# EAGLE design fonte (EAGLE 9.6.2)
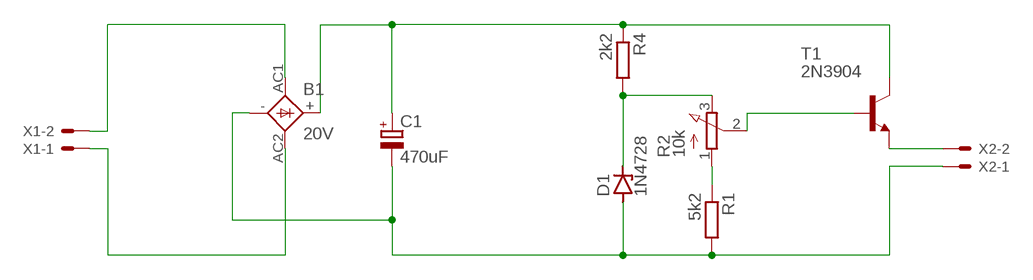
[diagram p0: schematic, sheet 1]

## Parts
B1  20V  1KAB  [1KAB]
C1  470uF  CPOL-EUE2,5-6E  [E2,5-6E]
D1  1N4728  [DO41Z10]
R1  5k2  R-EU_0207/10  [0207/10]
R2  10k  3RP/1610N  [3RP/1610N]
R4  2k2  R-EU_0207/10  [0207/10]
T1  2N3904  [TO92]
X1  22-23-2021  [22-23-2021]
X2  22-23-2021  [22-23-2021]

## Nets
N$1: B1.AC1 X1.2
N$2: B1.- C1.- D1.A R1.2 X2.1
N$3: R1.1 R2.1(A)
N$4: D1.C R2.3(E) R4.2
N$5: R2.2(S) T1.2(B)
N$6: B1.+ C1.+ R4.1 T1.1(C)
N$7: B1.AC2 X1.1
N$9: T1.3(E) X2.2

## Library data of the parts
B1 = rectifier:1KAB: RECTIFIER grid 5,08 x 5,08 mm
C1 = rcl:CPOL-EU: POLARIZED CAPACITOR, European symbol; SPICEPREFIX: C
D1 = diode:1N4728: Z DIODE 3.3 V, 1W, 5 percent
R1 R4 = rcl:R-EU_: RESISTOR, European symbol; SPICEPREFIX: R
R2 = pot:3RP/1610N: 16mm Potentiometer one level Source: http://www.alphapotentiometers.net/html/16mm_pot_2.html
T1 = transistor-neu-to92:2N3904: NPN TRANSISTOR
X1 X2 = con-molex:22-23-2021: .100" (2.54mm) Center Header - 2 Pin; MF: MOLEX; MPN: 22-23-2021; OC_FARNELL: 1462926; OC_NEWARK: 25C3832

## Board
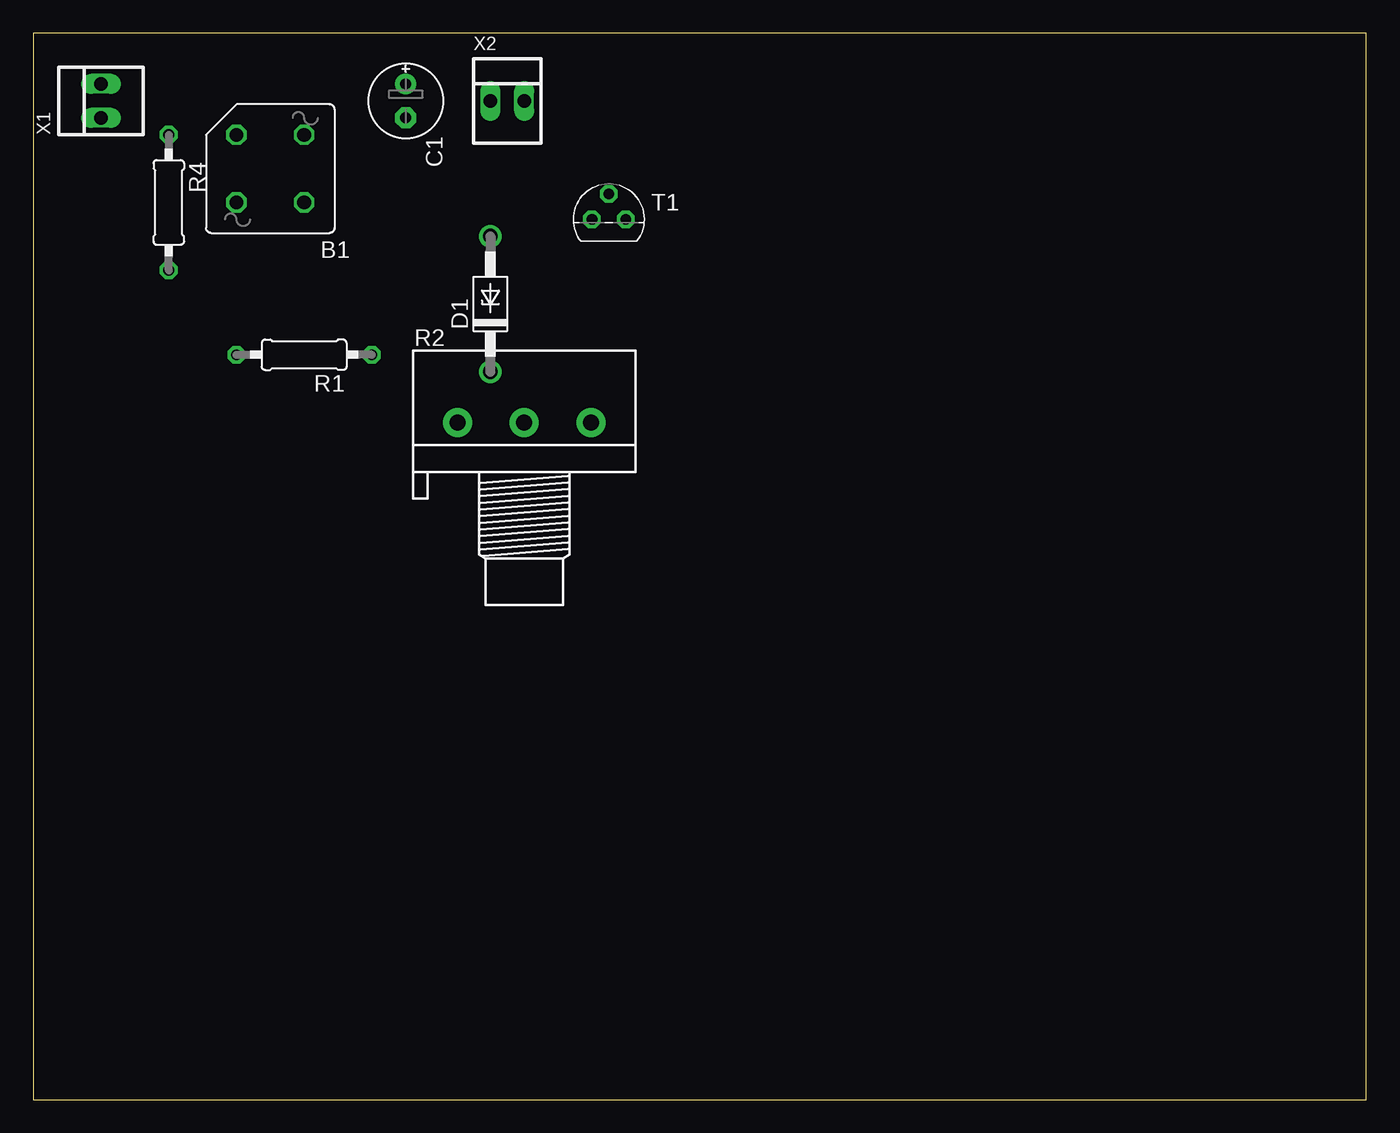
[diagram p1: board, top side]
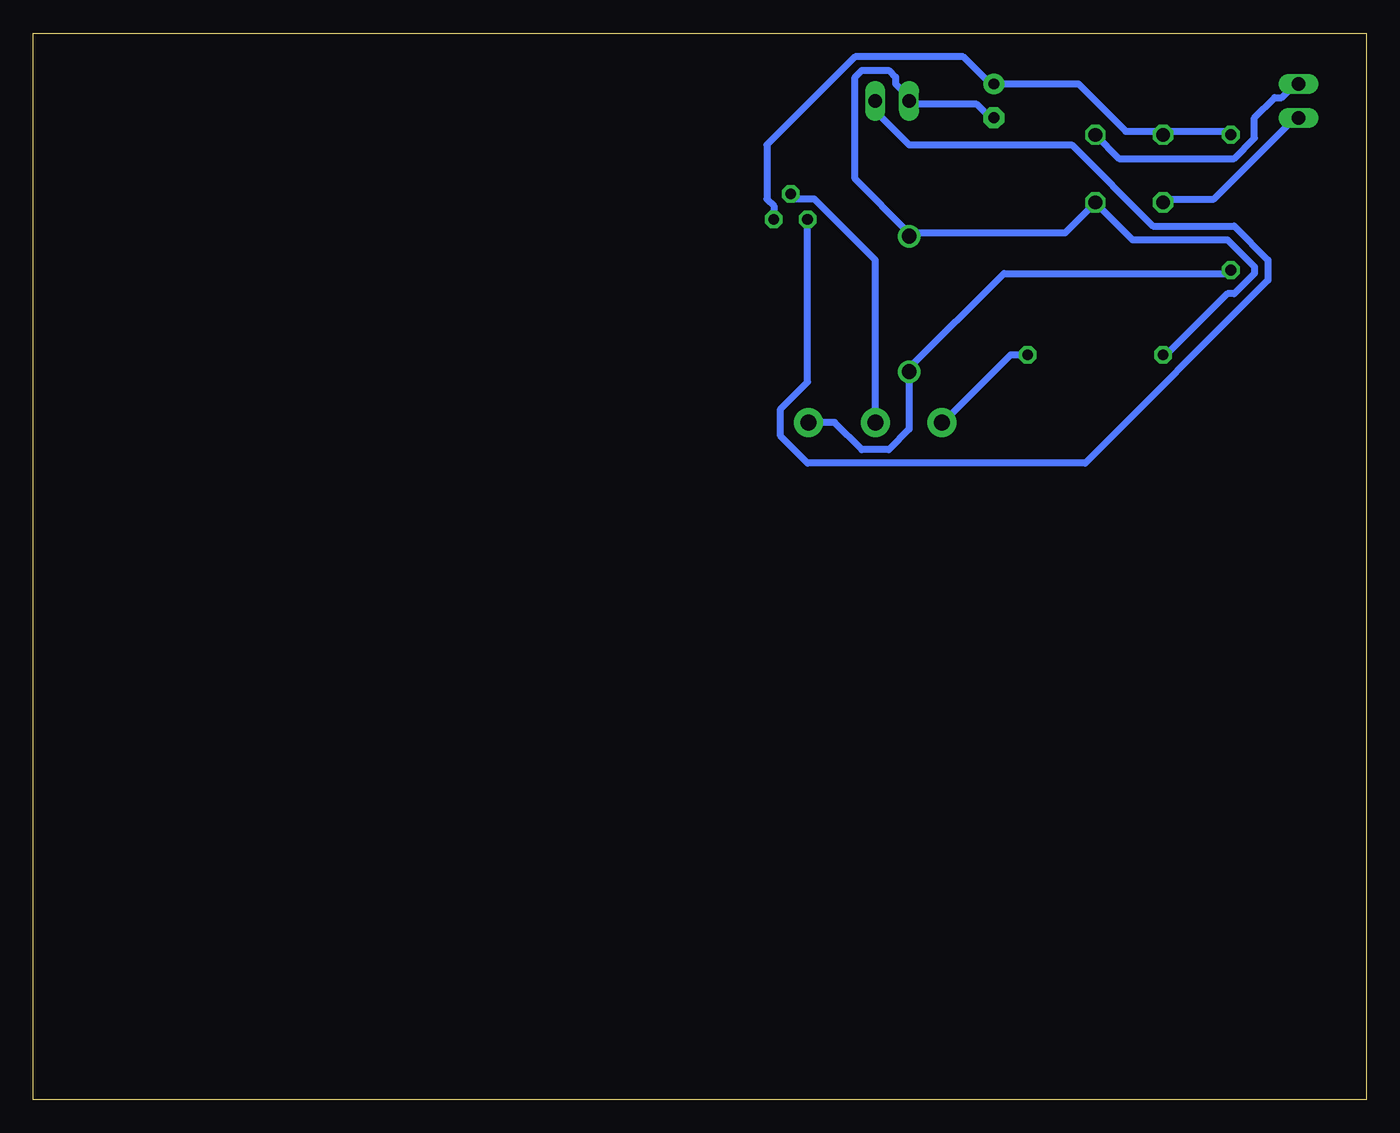
[diagram p2: board, bottom side, seen from below]

Size 100 x 80 mm. Coordinates in mm from the lower left corner, seen from the top.
Outline: 0,0 100,0 100,80 0,80 0,0
Copper layers (1*16): Top 0.035mm / dielectric 1.5mm / Bottom 0.035mm
Design rules "default *": minimum track width 20mil, minimum drill 0.35mm, track to track 20mil, track to pad 20mil, pad to pad 20mil, via to via 20mil, smd to smd 6mil, copper to edge 40mil, drill to drill 6mil, minimum pad ring 10mil, minimum via ring 8mil, stop-mask expansion 4mil, vias tented up to drill 0mil, thermal gap 10mil

### Footprints (pad centres in the part's own frame; a part is rotated, then mirrored left to right if it is on the bottom)
1KAB = drill 1.016 octagon: + 2.54,-2.54; - -2.54,2.54; AC1 -2.54,-2.54; AC2 2.54,2.54
E2,5-6E = drill 0.813 pad 1.575: + -1.27,0 | drill 0.813 pad 1.575 octagon: - 1.27,0
DO41Z10 = drill 1.118: A 5.08,0; C -5.08,0
0207/10 = drill 0.813 octagon: 1 -5.08,0; 2 5.08,0
3RP/1610N = drill 1.2 pad 2.184: 1 -5,0; 2 0,0; 3 5,0
TO92 = drill 0.813 octagon: 1 1.27,0; 2 0,1.905; 3 -1.27,0
22-23-2021 = drill 1 long: 1 -1.27,0; 2 1.27,0

### Placement (x,y rotation side)
B1  17.78,69.85 180 top
C1  27.94,74.93 270 top
D1  34.29,59.69 90 top
R1  20.32,55.88 180 top
R2  36.83,50.8 0 top
R4  10.16,67.31 270 top
T1  43.18,66.04 0 top
X1  5.08,74.93 90 top
X2  35.56,74.93 0 top

### Tracks (layer width: path | path; a pad name or v marks a point on that pad's centre or on a via)
N$1
  Bottom 0.508: B1.AC1 18.54,70.61 9.91,70.61 8.38,72.14 8.38,73.66 6.86,75.18 6.35,75.18 5.33,76.2 X1.2
N$2
  Bottom 0.508: C1.- 28.19,73.66 29.21,74.68 34.29,74.68 X2.1 34.29,75.18 35.31,76.2 35.31,76.71 35.81,77.22 37.85,77.22 38.35,76.71 38.35,69.09 34.29,65.02 | R1.2 14.99,55.88 10.41,60.45 9.91,60.45 8.38,61.98 8.38,62.48 10.41,64.52 17.53,64.52 B1.- 22.61,65.02 34.29,65.02 | 34.29,65.02 D1.A
N$3
  Bottom 0.508: R1.1 26.67,55.88 31.75,50.8 R2.1
N$4
  Bottom 0.508: R4.2 10.41,61.98 27.18,61.98 34.29,54.86 D1.C 34.29,50.29 35.81,48.77 37.85,48.77 39.88,50.8 R2.3
N$5
  Bottom 0.508: R2.2 36.83,62.99 41.4,67.56 42.93,67.56 T1.2
N$6
  Bottom 0.508: R4.1 10.41,72.64 14.99,72.64 B1.+ 15.49,72.64 18.03,72.64 21.59,76.2 C1.+ 28.19,76.2 30.23,78.23 38.35,78.23 44.96,71.63 44.96,67.56 44.45,67.06 T1.1
N$7
  Bottom 0.508: X1.1 5.33,73.66 11.43,67.56 14.99,67.56 B1.AC2
N$9
  Bottom 0.508: T1.3 41.91,53.85 43.94,51.82 43.94,49.78 41.91,47.75 21.08,47.75 7.37,61.47 7.37,62.99 9.91,65.53 16,65.53 22.1,71.63 34.29,71.63 36.83,74.17 X2.2